# Altium project Lens Heater.PrjPcb
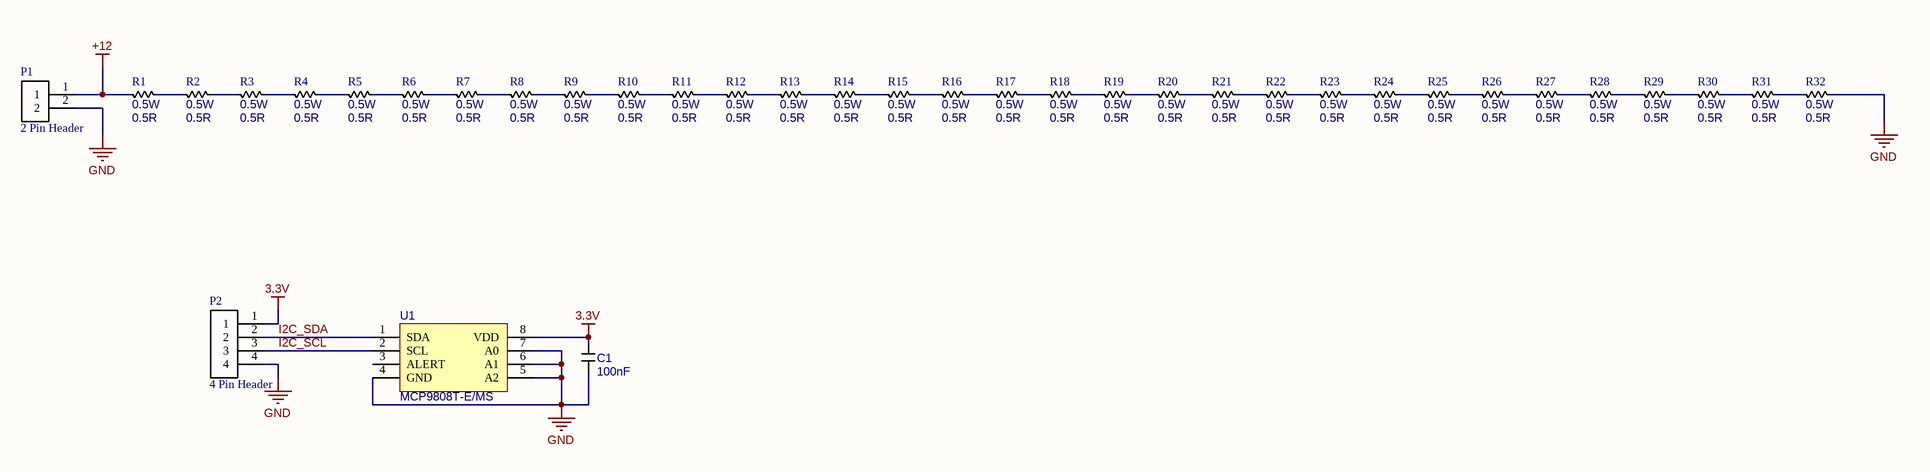
[diagram p0: Lens Heater.SchDoc]
1 sheet, 37 parts. Net scope: global (net labels, ports and power ports of the same name join across sheets).

## Sheet Lens Heater.SchDoc
size A3

### Parts
?  (no value)
C1  100nF  [C0805]
P1  2 Pin Header  [B2B-XH-A]
P2  4 Pin Header  [B4B-XH-A]
R1  Power Rating: 0.5W  Resistance: 0.5R  [R1210]  (hidden comment: Ω)
R2  Power Rating: 0.5W  Resistance: 0.5R  [R1210]  (hidden comment: Ω)
R3  Power Rating: 0.5W  Resistance: 0.5R  [R1210]  (hidden comment: Ω)
R4  Power Rating: 0.5W  Resistance: 0.5R  [R1210]  (hidden comment: Ω)
R5  Power Rating: 0.5W  Resistance: 0.5R  [R1210]  (hidden comment: Ω)
R6  Power Rating: 0.5W  Resistance: 0.5R  [R1210]  (hidden comment: Ω)
R7  Power Rating: 0.5W  Resistance: 0.5R  [R1210]  (hidden comment: Ω)
R8  Power Rating: 0.5W  Resistance: 0.5R  [R1210]  (hidden comment: Ω)
R9  Power Rating: 0.5W  Resistance: 0.5R  [R1210]  (hidden comment: Ω)
R10  Power Rating: 0.5W  Resistance: 0.5R  [R1210]  (hidden comment: Ω)
R11  Power Rating: 0.5W  Resistance: 0.5R  [R1210]  (hidden comment: Ω)
R12  Power Rating: 0.5W  Resistance: 0.5R  [R1210]  (hidden comment: Ω)
R13  Power Rating: 0.5W  Resistance: 0.5R  [R1210]  (hidden comment: Ω)
R14  Power Rating: 0.5W  Resistance: 0.5R  [R1210]  (hidden comment: Ω)
R15  Power Rating: 0.5W  Resistance: 0.5R  [R1210]  (hidden comment: Ω)
R16  Power Rating: 0.5W  Resistance: 0.5R  [R1210]  (hidden comment: Ω)
R17  Power Rating: 0.5W  Resistance: 0.5R  [R1210]  (hidden comment: Ω)
R18  Power Rating: 0.5W  Resistance: 0.5R  [R1210]  (hidden comment: Ω)
R19  Power Rating: 0.5W  Resistance: 0.5R  [R1210]  (hidden comment: Ω)
R20  Power Rating: 0.5W  Resistance: 0.5R  [R1210]  (hidden comment: Ω)
R21  Power Rating: 0.5W  Resistance: 0.5R  [R1210]  (hidden comment: Ω)
R22  Power Rating: 0.5W  Resistance: 0.5R  [R1210]  (hidden comment: Ω)
R23  Power Rating: 0.5W  Resistance: 0.5R  [R1210]  (hidden comment: Ω)
R24  Power Rating: 0.5W  Resistance: 0.5R  [R1210]  (hidden comment: Ω)
R25  Power Rating: 0.5W  Resistance: 0.5R  [R1210]  (hidden comment: Ω)
R26  Power Rating: 0.5W  Resistance: 0.5R  [R1210]  (hidden comment: Ω)
R27  Power Rating: 0.5W  Resistance: 0.5R  [R1210]  (hidden comment: Ω)
R28  Power Rating: 0.5W  Resistance: 0.5R  [R1210]  (hidden comment: Ω)
R29  Power Rating: 0.5W  Resistance: 0.5R  [R1210]  (hidden comment: Ω)
R30  Power Rating: 0.5W  Resistance: 0.5R  [R1210]  (hidden comment: Ω)
R31  Power Rating: 0.5W  Resistance: 0.5R  [R1210]  (hidden comment: Ω)
R32  Power Rating: 0.5W  Resistance: 0.5R  [R1210]  (hidden comment: Ω)
U1  MCP9808T-E/MS  [MCP9808T-E/MS]

### Nets
3.3V: C1.1 P2.1 U1.8(VDD)
+12: P1.1 R1.1
GND: C1.2 P1.2 P2.4 R32.2 U1.4(GND) U1.5(A2) U1.6(A1) U1.7(A0)
I2C_SCL: P2.3 U1.2(SCL)
I2C_SDA: P2.2 U1.1(SDA)
NetR1_2: R1.2 R2.1
NetR2_2: R2.2 R3.1
NetR3_2: R3.2 R4.1
NetR4_2: R4.2 R5.1
NetR5_2: R5.2 R6.1
NetR6_2: R6.2 R7.1
NetR7_2: R7.2 R8.1
NetR8_2: R8.2 R9.1
NetR9_2: R9.2 R10.1
NetR10_2: R10.2 R11.1
NetR11_2: R11.2 R12.1
NetR12_2: R12.2 R13.1
NetR13_2: R13.2 R14.1
NetR14_2: R14.2 R15.1
NetR15_2: R15.2 R16.1
NetR16_2: R16.2 R17.1
NetR17_2: R17.2 R18.1
NetR18_2: R18.2 R19.1
NetR19_2: R19.2 R20.1
NetR20_2: R20.2 R21.1
NetR21_2: R21.2 R22.1
NetR22_2: R22.2 R23.1
NetR23_2: R23.2 R24.1
NetR24_2: R24.2 R25.1
NetR25_2: R25.2 R26.1
NetR26_2: R26.2 R27.1
NetR27_2: R27.2 R28.1
NetR28_2: R28.2 R29.1
NetR29_2: R29.2 R30.1
NetR30_2: R30.2 R31.1
NetR31_2: R31.2 R32.1

Not connected (* = marked no-connect by the designer): U1 3(ALERT)

### Notes on the sheet
- UNLESS OTHERWISE SPECIFIED DIMENSIONS ARE IN MILLIMETERS
- NOTICE OF PROPRIETARY PROPERTY
- UNITS
- DRAWN BY
- CHECKED BY
- DATE
- TITLE
- APPROVED BY
- RELEASED BY
- SCALE:
- SIZE
- A3
- DRAWING NUMBER
- SHEET
- -
- OF
- THE INFORMATION CONTAINED HEREIN IS THE PROPRIETARY PROPERTY OF RIGBY ENGINEERING.
  THE POSSESSOR AGREES TO THE FOLLOWING:
  (i) TO MAINTAIN THIS DOCUMENT IN CONFIDENCE.
  (ii) NOT TO REPRODUCE OR COPY IT.
  (iii) NOT TO REVEAL OR PUBLISH IT IN WHOLE OR PART.
- File:

### Library data of the parts
? = Title Block
C1 = Capacitor: Manufacturer: YAGEO; Manufacturer Part Number: CC0805KRX7R9BB104; Tolerance: ±10%; Temperature Coefficient: X7R; Voltage Rating: 50V; Supplier: Digi-Key Electronics; Supplier Part Number: 311-1140-1-ND; Capacitance: 100nF
P1 = Header 2
P2 = Header 4: Manufacturer: *; Manufacturer Part Number: *; Supplier: *; Supplier Part Number: *
R1-R32 = Resistor: Standard Resistor; Manufacturer: YAGEO; Manufacturer Part Number: RL1210JR-070R5L; Supplier: Digi-Key Electronics; Supplier Part Number: 13-RL1210JR-070R5LCT-ND; Price: 0.463
U1 = MCP9808T-E/MS: Temperature Sensor Digital, Local -40°C ~ 125°C 12 b 8-MSOP; Manufacturer: Microchip Technology; Supplier: Digi-Key Electronics; Supplier Part Number: MCP9808T-E/MSCT-ND; Manufacturer Part Number: MCP9808T-E/MS